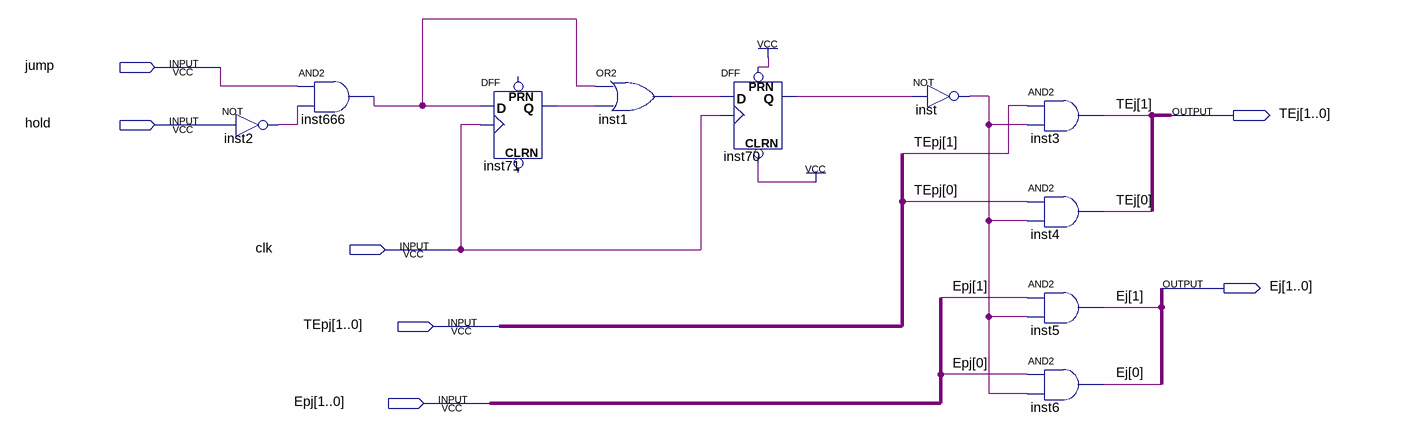
[diagram p0: schematic sheet]
// Quartus schematic E_jump.bdf as structural Verilog: 10 symbols, 7 pins
module E_jump (
  input  jump,
  input  hold,
  input  clk,
  input  [1:0] TEpj,
  input  [1:0] Epj,
  output [1:0] TEj,
  output [1:0] Ej
);

  wire inst1_out, inst2_out, inst70_q, inst71_q, inst666_out, inst_out;

  not inst2 (inst2_out, hold);
  and inst666 (inst666_out, jump, inst2_out);
  DFF inst71 (.CLK(clk), .D(inst666_out), .Q(inst71_q));  // open: CLRN, PRN
  or inst1 (inst1_out, inst666_out, inst71_q);
  DFF inst70 (.CLRN(1'b1), .CLK(clk), .D(inst1_out), .PRN(1'b1), .Q(inst70_q));
  not inst (inst_out, inst70_q);
  and inst3 (TEj[1], TEpj[1], inst_out);
  and inst4 (TEj[0], TEpj[0], inst_out);
  and inst5 (Ej[1], Epj[1], inst_out);
  and inst6 (Ej[0], Epj[0], inst_out);
endmodule
